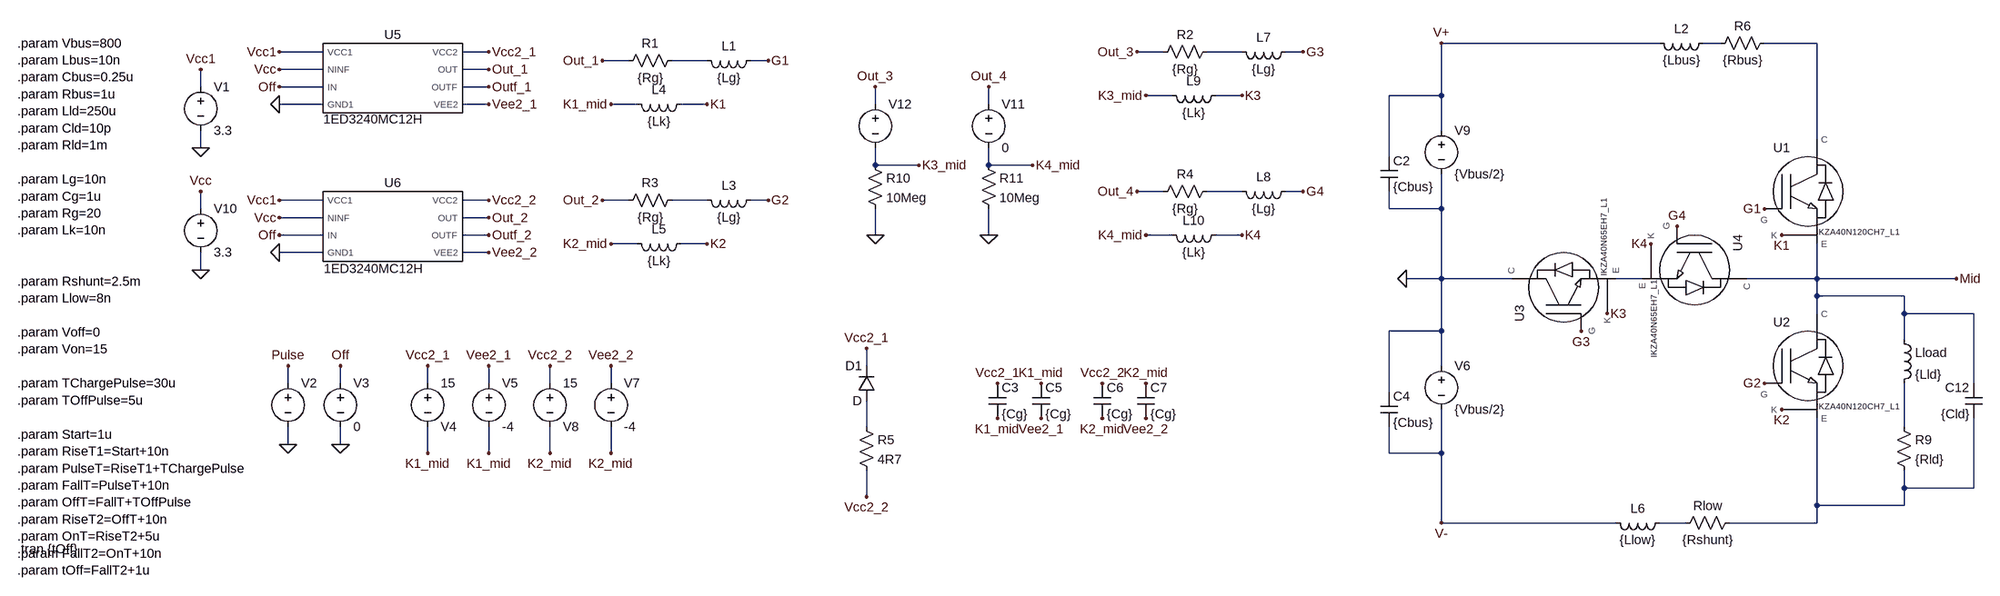
[diagram p0: schematic DPT_T-type_NPC_3L_2.asc]
DPT_T-type_NPC_3L_2.asc, the LTspice schematic file:
Version 4.1
SHEET 1 3392 1484
WIRE 2592 -16 2192 -16
WIRE 2704 -16 2672 -16
WIRE 2880 -16 2784 -16
WIRE -48 0 -128 0
WIRE 256 0 208 0
WIRE 1584 0 1536 0
WIRE 1728 0 1664 0
WIRE 1840 0 1808 0
WIRE 512 16 464 16
WIRE 656 16 592 16
WIRE 768 16 736 16
WIRE -48 32 -128 32
WIRE 256 32 208 32
WIRE -272 64 -272 32
WIRE -48 64 -128 64
WIRE 256 64 208 64
WIRE 1600 80 1552 80
WIRE 1728 80 1680 80
WIRE 2192 80 2192 -16
WIRE 2192 80 2096 80
WIRE -48 96 -128 96
WIRE 256 96 208 96
WIRE 528 96 480 96
WIRE 656 96 608 96
WIRE 1056 96 1056 64
WIRE 1264 96 1264 64
WIRE 2192 144 2192 80
WIRE 2880 160 2880 -16
WIRE -272 176 -272 144
WIRE 2096 192 2096 80
WIRE 1056 208 1056 176
WIRE 1136 208 1056 208
WIRE 1264 208 1264 176
WIRE 1344 208 1264 208
WIRE 1584 256 1536 256
WIRE 1728 256 1664 256
WIRE 1840 256 1808 256
WIRE -48 272 -128 272
WIRE 256 272 208 272
WIRE 512 272 464 272
WIRE 656 272 592 272
WIRE 768 272 736 272
WIRE -272 288 -272 256
WIRE 2096 288 2096 256
WIRE 2192 288 2192 224
WIRE 2192 288 2096 288
WIRE -48 304 -128 304
WIRE 256 304 208 304
WIRE -48 336 -128 336
WIRE 256 336 208 336
WIRE 1056 336 1056 288
WIRE 1264 336 1264 288
WIRE 1600 336 1552 336
WIRE 1728 336 1680 336
WIRE 528 352 480 352
WIRE 656 352 608 352
WIRE -48 368 -128 368
WIRE 256 368 208 368
WIRE -272 400 -272 368
WIRE 2192 416 2192 288
WIRE 2192 416 2128 416
WIRE 2320 416 2192 416
WIRE 2560 416 2512 416
WIRE 2880 416 2880 352
WIRE 2880 416 2752 416
WIRE 3136 416 2880 416
WIRE 2880 448 2880 416
WIRE 3040 448 2880 448
WIRE 2880 480 2880 448
WIRE 3040 480 3040 448
WIRE 3168 480 3040 480
WIRE 2192 512 2192 416
WIRE 2192 512 2096 512
WIRE 3040 528 3040 480
WIRE 1040 576 1040 544
WIRE 2192 576 2192 512
WIRE -112 608 -112 576
WIRE -16 608 -16 576
WIRE 144 608 144 576
WIRE 256 608 256 576
WIRE 368 608 368 576
WIRE 480 608 480 576
WIRE 3168 608 3168 480
WIRE 2096 624 2096 512
WIRE 1040 688 1040 640
WIRE 3040 688 3040 608
WIRE -112 720 -112 688
WIRE -16 720 -16 688
WIRE 144 736 144 688
WIRE 256 736 256 688
WIRE 368 736 368 688
WIRE 480 736 480 688
WIRE 2096 736 2096 688
WIRE 2192 736 2192 656
WIRE 2192 736 2096 736
WIRE 3040 800 3040 768
WIRE 3168 800 3168 672
WIRE 3168 800 3040 800
WIRE 1040 816 1040 768
WIRE 2880 832 2880 672
WIRE 3040 832 3040 800
WIRE 3040 832 2880 832
WIRE 2192 864 2192 736
WIRE 2512 864 2192 864
WIRE 2640 864 2592 864
WIRE 2880 864 2880 832
WIRE 2880 864 2720 864
FLAG -112 720 0
FLAG -16 720 0
FLAG 3136 416 Mid
FLAG -128 96 0
FLAG 768 272 G2
FLAG 2784 608 G2
FLAG -16 576 Off
FLAG -112 576 Pulse
FLAG 256 0 Vcc2_1
FLAG 256 272 Vcc2_2
FLAG 144 576 Vcc2_1
FLAG 256 576 Vee2_1
FLAG 256 368 Vee2_2
FLAG 256 736 K1_mid
FLAG 144 736 K1_mid
FLAG 480 576 Vee2_2
FLAG 480 736 K2_mid
FLAG 368 576 Vcc2_2
FLAG 368 736 K2_mid
FLAG -128 32 Vcc
FLAG -128 304 Vcc
FLAG 2192 -16 V+
FLAG 2192 864 V-
FLAG 2816 656 K2
FLAG 256 96 Vee2_1
FLAG 2816 336 K1
FLAG 768 16 G1
FLAG 2784 288 G1
FLAG 464 16 Out_1
FLAG 256 32 Out_1
FLAG 256 64 Outf_1
FLAG 256 304 Out_2
FLAG 464 272 Out_2
FLAG 256 336 Outf_2
FLAG 1040 544 Vcc2_1
FLAG 1040 816 Vcc2_2
FLAG -128 368 0
FLAG -128 64 Off
FLAG -128 336 Off
FLAG 656 96 K1
FLAG 656 352 K2
FLAG 480 96 K1_mid
FLAG 480 352 K2_mid
FLAG 1280 608 Vcc2_1
FLAG 1280 672 K1_mid
FLAG 1360 608 K1_mid
FLAG 1360 672 Vee2_1
FLAG 1472 608 Vcc2_2
FLAG 1472 672 K2_mid
FLAG 1552 608 K2_mid
FLAG 1552 672 Vee2_2
FLAG -272 400 0
FLAG -272 256 Vcc
FLAG -272 32 Vcc1
FLAG -128 0 Vcc1
FLAG -128 272 Vcc1
FLAG 1840 256 G4
FLAG 1840 0 G3
FLAG 1536 0 Out_3
FLAG 1536 256 Out_4
FLAG 1728 80 K3
FLAG 1728 336 K4
FLAG 1552 80 K3_mid
FLAG 1552 336 K4_mid
FLAG 2496 480 K3
FLAG 2576 352 K4
FLAG 2448 512 G3
FLAG 2624 320 G4
FLAG -272 176 0
FLAG 1056 64 Out_3
FLAG 1264 64 Out_4
FLAG 1056 336 0
FLAG 1264 336 0
FLAG 1136 208 K3_mid
FLAG 1344 208 K4_mid
FLAG 2128 416 0
SYMBOL voltage -272 48 R0
WINDOW 123 0 0 Left 0
WINDOW 39 0 0 Left 0
SYMATTR InstName V1
SYMATTR Value 3.3
SYMBOL voltage -112 592 R0
WINDOW 3 24 44 Invisible 2
WINDOW 123 0 0 Left 0
WINDOW 39 0 0 Left 0
SYMATTR Value PWL(0u {Voff} {Start} {Voff} {RiseT1} {Von} {PulseT} {Von} {FallT} {Voff} {offT} {Voff} {RiseT2} {Von} {OnT} {Von} {FallT2} {Voff})
SYMATTR InstName V2
SYMBOL voltage 144 592 R0
WINDOW 0 24 96 Left 2
WINDOW 3 24 16 Left 2
WINDOW 123 0 0 Left 0
WINDOW 39 0 0 Left 0
SYMATTR InstName V4
SYMATTR Value 15
SYMBOL voltage 2192 560 R0
WINDOW 123 0 0 Left 0
WINDOW 39 24 124 Left 2
SYMATTR InstName V6
SYMATTR Value {Vbus/2}
SYMBOL ind 2688 -32 R90
WINDOW 0 5 56 VBottom 2
WINDOW 3 32 56 VTop 2
SYMATTR InstName L2
SYMATTR Value {Lbus}
SYMBOL res 2736 848 R90
WINDOW 0 0 56 VBottom 2
WINDOW 3 32 56 VTop 2
SYMATTR InstName Rlow
SYMATTR Value {Rshunt}
SYMBOL 1ED3240MC12H -48 -16 R0
WINDOW 3 92 155 Bottom 2
SYMATTR InstName U5
SYMBOL 1ED3240MC12H -48 256 R0
WINDOW 3 93 157 Bottom 2
SYMATTR InstName U6
SYMBOL voltage -16 592 R0
WINDOW 123 0 0 Left 0
WINDOW 39 0 0 Left 0
SYMATTR InstName V3
SYMATTR Value 0
SYMBOL res 608 0 R90
WINDOW 0 0 56 VBottom 2
WINDOW 3 32 56 VTop 2
SYMATTR InstName R1
SYMATTR Value {Rg}
SYMBOL res 608 256 R90
WINDOW 0 0 56 VBottom 2
WINDOW 3 32 56 VTop 2
SYMATTR InstName R3
SYMATTR Value {Rg}
SYMBOL voltage 256 592 R0
WINDOW 123 0 0 Left 0
WINDOW 39 0 0 Left 0
SYMATTR InstName V5
SYMATTR Value -4
SYMBOL voltage 480 592 R0
WINDOW 123 0 0 Left 0
WINDOW 39 0 0 Left 0
SYMATTR InstName V7
SYMATTR Value -4
SYMBOL voltage 368 592 R0
WINDOW 0 24 96 Left 2
WINDOW 3 24 16 Left 2
WINDOW 123 0 0 Left 0
WINDOW 39 0 0 Left 0
SYMATTR InstName V8
SYMATTR Value 15
SYMBOL diode 1056 640 R180
WINDOW 0 24 64 Left 2
WINDOW 3 24 0 Left 2
SYMATTR InstName D1
SYMBOL res 1024 672 R0
SYMATTR InstName R5
SYMATTR Value 4R7
SYMBOL ind 752 0 R90
WINDOW 0 5 56 VBottom 2
WINDOW 3 32 56 VTop 2
SYMATTR InstName L1
SYMATTR Value {Lg}
SYMBOL ind 752 256 R90
WINDOW 0 5 56 VBottom 2
WINDOW 3 32 56 VTop 2
SYMATTR InstName L3
SYMATTR Value {Lg}
SYMBOL ind 624 80 R90
WINDOW 0 5 56 VBottom 2
WINDOW 3 32 56 VTop 2
SYMATTR InstName L4
SYMATTR Value {Lk}
SYMBOL ind 624 336 R90
WINDOW 0 5 56 VBottom 2
WINDOW 3 32 56 VTop 2
SYMATTR InstName L5
SYMATTR Value {Lk}
SYMBOL res 2800 -32 R90
WINDOW 0 0 56 VBottom 2
WINDOW 3 32 56 VTop 2
SYMATTR InstName R6
SYMATTR Value {Rbus}
SYMBOL cap 2080 192 R0
SYMATTR InstName C2
SYMATTR Value {Cbus}
SYMBOL IGBT_1200V 2800 192 R0
SYMATTR InstName U1
SYMBOL IGBT_1200V 2800 512 R0
SYMATTR InstName U2
SYMBOL IGBT_650V 2352 496 R270
SYMATTR InstName U3
SYMBOL IGBT_650V 2720 336 R90
SYMATTR InstName U4
SYMBOL voltage 2192 128 R0
WINDOW 123 0 0 Left 0
WINDOW 39 24 124 Left 2
SYMATTR InstName V9
SYMATTR Value {Vbus/2}
SYMBOL cap 2080 624 R0
SYMATTR InstName C4
SYMATTR Value {Cbus}
SYMBOL ind 2608 848 R90
WINDOW 0 5 56 VBottom 2
WINDOW 3 32 56 VTop 2
SYMATTR InstName L6
SYMATTR Value {Llow}
SYMBOL cap 1264 608 R0
SYMATTR InstName C3
SYMATTR Value {Cg}
SYMBOL cap 1344 608 R0
SYMATTR InstName C5
SYMATTR Value {Cg}
SYMBOL cap 1456 608 R0
SYMATTR InstName C6
SYMATTR Value {Cg}
SYMBOL cap 1536 608 R0
SYMATTR InstName C7
SYMATTR Value {Cg}
SYMBOL voltage -272 272 R0
WINDOW 123 0 0 Left 0
WINDOW 39 0 0 Left 0
SYMATTR InstName V10
SYMATTR Value 3.3
SYMBOL res 1680 -16 R90
WINDOW 0 0 56 VBottom 2
WINDOW 3 32 56 VTop 2
SYMATTR InstName R2
SYMATTR Value {Rg}
SYMBOL res 1680 240 R90
WINDOW 0 0 56 VBottom 2
WINDOW 3 32 56 VTop 2
SYMATTR InstName R4
SYMATTR Value {Rg}
SYMBOL ind 1824 -16 R90
WINDOW 0 5 56 VBottom 2
WINDOW 3 32 56 VTop 2
SYMATTR InstName L7
SYMATTR Value {Lg}
SYMBOL ind 1824 240 R90
WINDOW 0 5 56 VBottom 2
WINDOW 3 32 56 VTop 2
SYMATTR InstName L8
SYMATTR Value {Lg}
SYMBOL ind 1696 64 R90
WINDOW 0 5 56 VBottom 2
WINDOW 3 32 56 VTop 2
SYMATTR InstName L9
SYMATTR Value {Lk}
SYMBOL ind 1696 320 R90
WINDOW 0 5 56 VBottom 2
WINDOW 3 32 56 VTop 2
SYMATTR InstName L10
SYMATTR Value {Lk}
SYMBOL ind 3024 512 R0
SYMATTR InstName Lload
SYMATTR Value {Lld}
SYMBOL cap 3184 672 R180
WINDOW 0 24 56 Left 2
WINDOW 3 24 8 Left 2
SYMATTR InstName C12
SYMATTR Value {Cld}
SYMBOL res 3024 672 R0
SYMATTR InstName R9
SYMATTR Value {Rld}
SYMBOL res 1040 192 R0
SYMATTR InstName R10
SYMATTR Value 10Meg
SYMBOL res 1248 192 R0
SYMATTR InstName R11
SYMATTR Value 10Meg
SYMBOL voltage 1264 80 R0
WINDOW 123 0 0 Left 0
WINDOW 39 0 0 Left 0
SYMATTR InstName V11
SYMATTR Value 0
SYMBOL voltage 1056 80 R0
WINDOW 3 24 44 Invisible 2
WINDOW 123 0 0 Left 0
WINDOW 39 0 0 Left 0
SYMATTR Value PWL(0u {Voff} {Start} {Voff} {RiseT1} {Von} {PulseT} {Von} {FallT} {Voff} {offT} {Voff} {RiseT2} {Von} {OnT} {Von} {FallT2} {Voff})
SYMATTR InstName V12
TEXT -608 -16 Left 2 !.param Vbus=800\n.param Lbus=10n\n.param Cbus=0.25u\n.param Rbus=1u\n.param Lld=250u\n.param Cld=10p\n.param Rld=1m\n \n.param Lg=10n\n.param Cg=1u\n.param Rg=20\n.param Lk=10n\n \n \n.param Rshunt=2.5m\n.param Llow=8n\n \n.param Voff=0\n.param Von=15\n \n.param TChargePulse=30u\n.param TOffPulse=5u\n \n.param Start=1u\n.param RiseT1=Start+10n\n.param PulseT=RiseT1+TChargePulse\n.param FallT=PulseT+10n\n.param OffT=FallT+TOffPulse\n.param RiseT2=OffT+10n \n.param OnT=RiseT2+5u\n.param FallT2=OnT+10n\n.param tOff=FallT2+1u
TEXT -608 912 Left 2 !.tran {tOff}

The netlist it stands for:
* DPT_T-type_NPC_3L_2.asc
V1 Vcc1 0 3.3
V2 Pulse 0 PWL(0u {Voff} {Start} {Voff} {RiseT1} {Von} {PulseT} {Von} {FallT} {Voff} {offT} {Voff} {RiseT2} {Von} {OnT} {Von} {FallT2} {Voff})
V4 Vcc2_1 K1_mid 15
V6 0 V- {Vbus/2}
L2 N001 V+ {Lbus}
Rlow N010 N011 {Rshunt}
X§U5 Vcc1 Vcc Off 0 Vcc2_1 Out_1 Outf_1 Vee2_1 1ED3240MC12H  ; pins VCC1 NINF IN GND1 VCC2 OUT OUTF VEE2
X§U6 Vcc1 Vcc Off 0 Vcc2_2 Out_2 Outf_2 Vee2_2 1ED3240MC12H  ; pins VCC1 NINF IN GND1 VCC2 OUT OUTF VEE2
V3 Off 0 0
R1 N004 Out_1 {Rg}
R3 N006 Out_2 {Rg}
V5 Vee2_1 K1_mid -4
V7 Vee2_2 K2_mid -4
V8 Vcc2_2 K2_mid 15
D1 N008 Vcc2_1 D
R5 N008 Vcc2_2 4R7
L1 G1 N004 {Lg}
L3 G2 N006 {Lg}
L4 K1 K1_mid {Lk}
L5 K2 K2_mid {Lk}
R6 N002 N001 {Rbus}
C2 V+ 0 {Cbus}
X§U1 N002 G1 Mid K1 IKZA40N120CH7_L1  ; pins C G E K
X§U2 Mid G2 N010 K2 IKZA40N120CH7_L1  ; pins C G E K
X§U3 0 G3 N007 K3 IKZA40N65EH7_L1  ; pins C G E K
X§U4 Mid G4 N007 K4 IKZA40N65EH7_L1  ; pins C G E K
V9 V+ 0 {Vbus/2}
C4 0 V- {Cbus}
L6 N011 V- {Llow}
C3 Vcc2_1 K1_mid {Cg}
C5 K1_mid Vee2_1 {Cg}
C6 Vcc2_2 K2_mid {Cg}
C7 K2_mid Vee2_2 {Cg}
V10 Vcc 0 3.3
R2 N003 Out_3 {Rg}
R4 N005 Out_4 {Rg}
L7 G3 N003 {Lg}
L8 G4 N005 {Lg}
L9 K3 K3_mid {Lk}
L10 K4 K4_mid {Lk}
Lload Mid N009 {Lld}
C12 N010 Mid {Cld}
R9 N009 N010 {Rld}
R10 K3_mid 0 10Meg
R11 K4_mid 0 10Meg
V11 Out_4 K4_mid 0
V12 Out_3 K3_mid PWL(0u {Voff} {Start} {Voff} {RiseT1} {Von} {PulseT} {Von} {FallT} {Voff} {offT} {Voff} {RiseT2} {Von} {OnT} {Von} {FallT2} {Voff})
.model D D
.lib standard.dio
.param Vbus=800
.param Lbus=10n
.param Cbus=0.25u
.param Rbus=1u
.param Lld=250u
.param Cld=10p
.param Rld=1m
.param Lg=10n
.param Cg=1u
.param Rg=20
.param Lk=10n
.param Rshunt=2.5m
.param Llow=8n
.param Voff=0
.param Von=15
.param TChargePulse=30u
.param TOffPulse=5u
.param Start=1u
.param RiseT1=Start+10n
.param PulseT=RiseT1+TChargePulse
.param FallT=PulseT+10n
.param OffT=FallT+TOffPulse
.param RiseT2=OffT+10n
.param OnT=RiseT2+5u
.param FallT2=OnT+10n
.param tOff=FallT2+1u
.tran {tOff}
.lib 1ED3240MC12H.lib
.lib IGBT_1200V_TRENCHSTOP_IGBT7_H7_L1.lib
.lib IGBT_650V_TRENCHSTOP_IGBT7_H7_L1.lib
.backanno
.end